# Altium schematic sheet Overview.SchDoc
size 420 x 297 mm; SheetNumber: 1; SheetTotal: 6
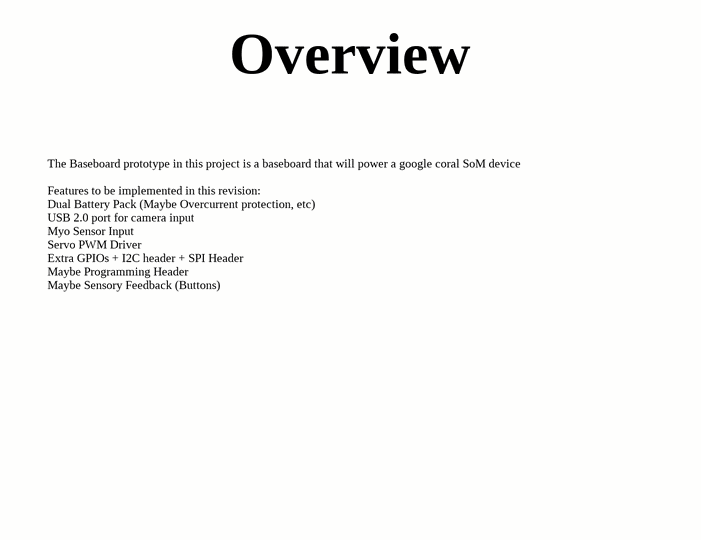
[diagram p0: Overview.SchDoc]

## Notes on the sheet
- Overview
- The Baseboard prototype in this project is a baseboard that will power a google coral SoM device
  Features to be implemented in this revision:
  Dual Battery Pack (Maybe Overcurrent protection, etc)
  USB 2.0 port for camera input
  Myo Sensor Input
  Servo PWM Driver
  Extra GPIOs + I2C header + SPI Header
  Maybe Programming Header
  Maybe Sensory Feedback (Buttons)
- THIS DOCUMENT AND THE DATA DISCLOSED HEREIN OR
- HEREWITH IS THE PROPERTY OF ALTIUM LIMITED AND MAY
- DWG NO:
- REVISION
- REV:
- DESCRIPTION
- DATE
- APPROVED
- BE FREELY DISTRIBUTED IN WHOLE. NO RIGHTS ARE
- RESERVED OR EXPRESS OR IMPLIED WARANTEE GIVEN.
- ENG:
- APPROVALS
- PROJECT
- DSN:
- CHK:
- REFERENCE DOCUMENTS
- PROJECT REVISION:
- TITLE
- DOCUMENT REVISION:
- DESIGN ITEM:
- BOM:
- FAB DWG:
- PCB DWG:
- ASSY DWG:
- SCALE:
- A3
- SIZE
- CAGE CODE
- FILE NAME
- DWG NO.
- SHEET
- OF
- REV